# Altium schematic sheet pca10028_buttons_and_leds.SchDoc: PCA10028 - Buttons and LEDs
size A4; Revision: 1.0.0; SheetNumber: 3; SheetTotal: 5; DrawnBy: RUBR; ProjectNumber: 4403; PCBRevision: 0169RUBR; DocumentSize: A4; PCAName: PCA10028; PCBNumber: 400092; ProjectName: Cost optimized nRF51-EK
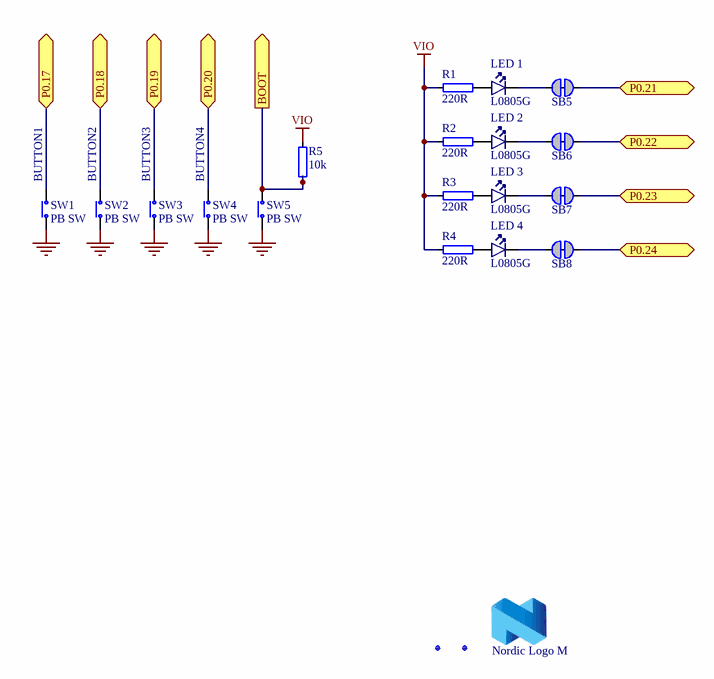
[diagram p0: pca10028_buttons_and_leds.SchDoc]

## Parts
Fid1  Fiducial mark  [Fiducial]  (value not drawn)
Fid2  Fiducial mark  [Fiducial]  (value not drawn)
LED_1  L0805G  [LED_0805_G]
LED_2  L0805G  [LED_0805_G]
LED_3  L0805G  [LED_0805_G]
LED_4  L0805G  [LED_0805_G]
LOGO1  Nordic Logo M  [NORDIC_LOGO_M]  (no BOM)
R1  220R  [RESC1005X04L]
R2  220R  [RESC1005X04L]
R3  220R  [RESC1005X04L]
R4  220R  [RESC1005X04L]
R5  10k  [RESC1005X04L]
SB5  Solderbridge  [Solderbridge_Shorted]  (value not drawn)  (net tie, no BOM)
SB6  Solderbridge  [Solderbridge_Shorted]  (value not drawn)  (net tie, no BOM)
SB7  Solderbridge  [Solderbridge_Shorted]  (value not drawn)  (net tie, no BOM)
SB8  Solderbridge  [Solderbridge_Shorted]  (value not drawn)  (net tie, no BOM)
SW1  PB SW  [ALPS_SKHUxxx010_WO_GND]
SW2  PB SW  [ALPS_SKHUxxx010_WO_GND]
SW3  PB SW  [ALPS_SKHUxxx010_WO_GND]
SW4  PB SW  [ALPS_SKHUxxx010_WO_GND]
SW5  PB SW  [ALPS_SKHUxxx010_WO_GND]

## Ports
BOOT (out), P0.17 (bidir), P0.18 (bidir), P0.19 (bidir), P0.20 (bidir), P0.21 (bidir), P0.22 (bidir), P0.23 (bidir), P0.24 (bidir)

## Nets
GND: SW1.2(COM) SW2.2(COM) SW3.2(COM) SW4.2(COM) SW5.2(COM)
VIO: R1.2 R2.2 R3.2 R4.2 R5.2
BOOT: R5.1 SW5.1(N.O) ; port BOOT
P0.17: SW1.1(N.O) ; port P0.17
P0.18: SW2.1(N.O) ; port P0.18
P0.19: SW3.1(N.O) ; port P0.19
P0.20: SW4.1(N.O) ; port P0.20
P0.21: SB5.1 ; port P0.21
P0.22: SB6.1 ; port P0.22
P0.23: SB7.1 ; port P0.23
P0.24: SB8.1 ; port P0.24
NetLED_1_1: LED_1.1(C) SB5.2
NetLED_1_2: LED_1.2(A) R1.1
NetLED_2_1: LED_2.1(C) SB6.2
NetLED_2_2: LED_2.2(A) R2.1
NetLED_3_1: LED_3.1(C) SB7.2
NetLED_3_2: LED_3.2(A) R3.1
NetLED_4_1: LED_4.1(C) SB8.2
NetLED_4_2: LED_4.2(A) R4.1

## Notes on the sheet
- (near SW1) BUTTON1
- (near SW2) BUTTON2
- (near SW3) BUTTON3
- (near SW4) BUTTON4
- Title
- Size
- Date:
- Project Number
- Sheet         of
- Revision
- File:
- Drawn By:

## Library data of the parts
Fid1 Fid2 = Fid-Mark: Artikkelnr Noca: N.A.; Part Number: Fid-Mark; Manufacturer: *; Manufacturer Part Number: *; Datasheet: *; LatestRevisionDate: 2009-12-12; Pin Count: 1; Publisher: Nordic Semiconductor; Published: 2009-12-12; Value: *; Note: *; Supplier: *; Supplier part number: *; 2nd source Supplier: *; 2nd source part number: *; Footprint Doc: Fiducial; Artikkelnr Simpro: N.A.
LED_1-LED_4 = SML-210PT: LED, SMD, 0805, GREEN; Manufacturer: ROHM; Manufacturer Part Number: SML-210PTT86; Note: 4 mcd @ 20 mA; Artikkelnr Noca: 13019123; Artikkelnr Simpro: N.A.; Part Number: SML-210PT; Datasheet: http://no.farnell.com/rohm/sml-210dtt86/led-smd-0805-orange/dp/1685051; LatestRevisionDate: 2009-09-03; Pin Count: 2; Publisher: Nordic Semiconductor; Published: 2009-09-03; Value: L0805G; Supplier: *; Supplier part number: *; 2nd source Supplier: *; 2nd source part number: *; Footprint Doc: 0805
LOGO1 = Nordic Logo M: Nordic Logo, medium size; Artikkelnr Noca: N.A.; Part Number: Nordic Logo M; Manufacturer: *; Manufacturer Part Number: *; Datasheet: *; LatestRevisionDate: 2010-02-18; Publisher: Nordic Semiconductor; Value: Nordic Logo M; Note: *; Supplier: *; Supplier part number: *; 2nd source Supplier: *; 2nd source part number: *; Pin Count: 2; Published: 2010-02-18; Footprint Doc: NORDIC_LOGO_M; Artikkelnr Simpro: N.A.
R1-R4 = R0402-220: Resistor, ±1%, 0.063W; Note: Chip Res 1%; Artikkelnr Noca: 27049057; Artikkelnr Simpro: N.A.; Part Number: R0402-220; Manufacturer: *; Manufacturer Part Number: *; Datasheet: *; LatestRevisionDate: 2009-11-23; Pin Count: 2; Publisher: Nordic Semiconductor; Published: 2009-05-08; Value: 220R; Supplier: Farnell; Supplier part number: 173-8841; 2nd source Supplier: *; 2nd source part number: *; Footprint Doc: 0402
R5 = R0402-10k: Resistor, ±1%, 0.063W; Note: Chip Res 1%; Artikkelnr Noca: 27049097; Artikkelnr Simpro: N.A.; Part Number: R0402-10k; Manufacturer: *; Manufacturer Part Number: *; Datasheet: *; LatestRevisionDate: 2009-11-23; Pin Count: 2; Publisher: Nordic Semiconductor; Published: 2009-05-08; Value: 10k; Supplier: Farnell; Supplier part number: 173-8864; 2nd source Supplier: *; 2nd source part number: *; Footprint Doc: 0402
SB5-SB8 = Solderbridge Shorted: Shorted Solderbridge; Artikkelnr Noca: N.A.; Part Number: Solderbridge Shorted; Manufacturer: *; Manufacturer Part Number: *; Datasheet: *; LatestRevisionDate: 2012-08-07; Pin Count: 2; Publisher: Nordic Semiconductor; Published: 2012-08-07; Value: Solderbridge; Note: *; Supplier: *; Supplier part number: *; 2nd source Supplier: *; 2nd source part number: *; Footprint Doc: Solderbridge_Shorted; Artikkelnr Simpro: N.A.
SW1-SW5 = ALPS_SKHUALE010: ALPS - SKHUALE010 - Tactile Switch, SPNO, SMD, 6.5x6.2x2.5mm; 2nd source part number: 688-SKHUALE010; Artikkelnr Noca: 50019001; Artikkelnr Simpro: N.A.; Part Number: ALPS_SKHUALE010; Manufacturer: Alps; Manufacturer Part Number: SKHUALE010; Datasheet: https://www1.elfa.se/data1/wwwroot/webroot/Z_DATA/03579000.pdf; LatestRevisionDate: 2010-02-01; Pin Count: 4; Publisher: Nordic Semiconductor; Published: 2010-02-01; Value: PB SW; Note: *; Supplier: Elfa; Supplier part number: 35-790-00; 2nd source Supplier: Mouser; Footprint Doc: ALPS_SKHUxxx010_WO_GND